# EAGLE design flower (EAGLE 6.1)
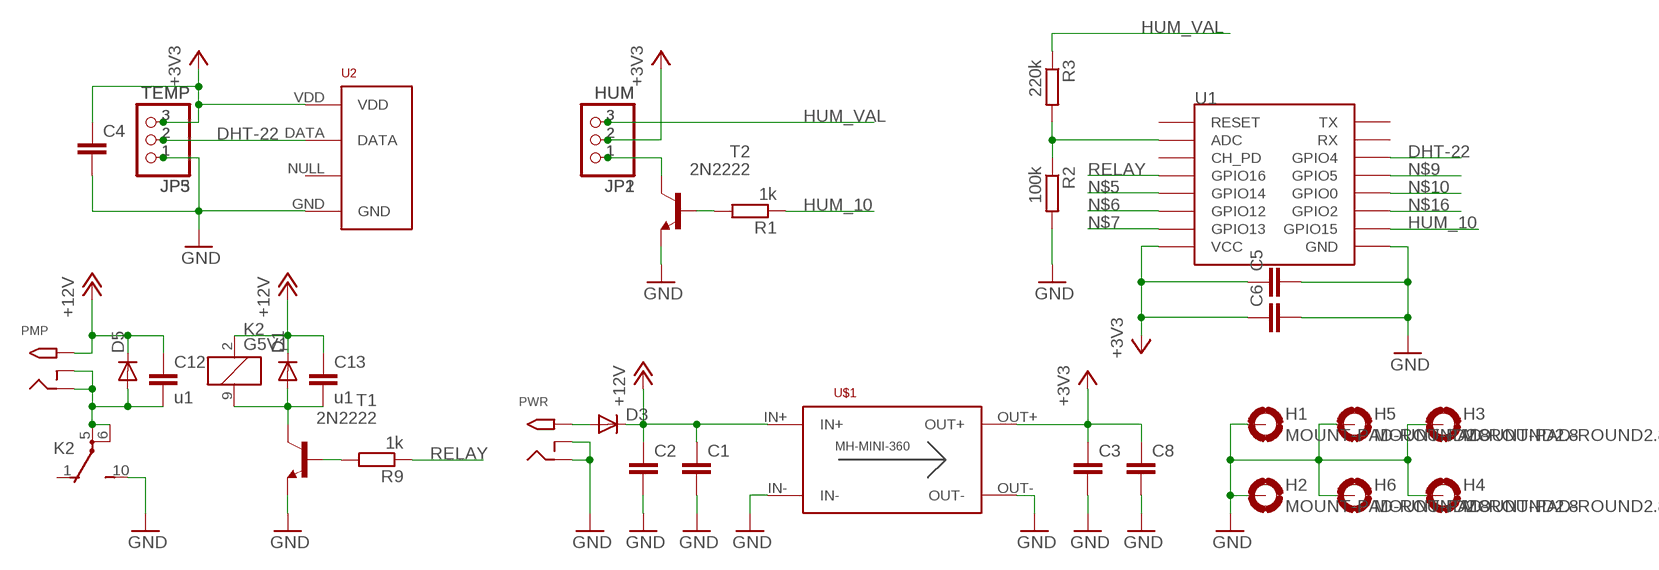
[diagram p0: schematic, sheet 1]

## Parts
C1  C-EU025-025X050  [C025-025X050]
C2  C-EUC0805K  [C0805K]
C3  C-EU025-025X050  [C025-025X050]
C4  C-EU025-025X050  [C025-025X050]
C5  C-EU025-025X050  [C025-025X050]
C6  C-EU025-025X050  [C025-025X050]
C8  C-EUC0805K  [C0805K]
C12  u1  C-EU025-025X050  [C025-025X050]
C13  u1  C-EU025-025X050  [C025-025X050]
D1  DIODE-D-5  [D-5]
D3  DIODE-D-5  [D-5]
D5  DIODE-D-5  [D-5]
H1  MOUNT-PAD-ROUND2.8  [2,8-PAD]
H2  MOUNT-PAD-ROUND2.8  [2,8-PAD]
H3  MOUNT-PAD-ROUND2.8  [2,8-PAD]
H4  MOUNT-PAD-ROUND2.8  [2,8-PAD]
H5  MOUNT-PAD-ROUND2.8  [2,8-PAD]
H6  MOUNT-PAD-ROUND2.8  [2,8-PAD]
JP1  HUM  PINHD-1X3/90  [1X03/90]
JP2  HUM  PINHD-1X3  [1X03]
JP3  TEMP  PINHD-1X3  [1X03]
JP5  TEMP  PINHD-1X3/90  [1X03/90]
K2  G5V1  [G5V1]
PMP  PMP  2.1MMJACKTHM  [PJ-102A]
PWR  PWR  2.1MMJACKTHM  [PJ-102A]
R1  1k  R-EU_0204/7  [0204/7]
R2  100k  R-EU_0204/7  [0204/7]
R3  220k  R-EU_0204/7  [0204/7]
R9  1k  R-EU_0207/10  [0207/10]
T1  2N2222  [TO92-EBC-OVAL]
T2  2N2222  [TO92-EBC-OVAL]
U1  ESP12EDIP  [ESP-12-BREAKOUT]
U2  RHT03_DHT-22_AM2302RA  [RHT03_DHT-22/RA]
U$1  DC-DC_CONV_MINISTD  [DC-DC_CONV_MINI]

## Nets
+3V3: C3.1 C4.1 C5.1 C6.1 C8.1 JP1.2 JP2.2 JP3.3 JP5.3 U1.P$1(VCC) U2.VDD U$1.OUT+
+12V: C1.1 C2.1 C12.1 C13.1 D1.C D3.C D5.C K2.2 PMP.TIP U$1.IN+
DHT-22: JP3.2 JP5.2 U1.P$14(GPIO4) U2.DATA
GND: C1.2 C2.2 C3.2 C4.2 C5.2 C6.2 C8.2 H1.B2,8(MOUNT) H2.B2,8(MOUNT) H3.B2,8(MOUNT) H4.B2,8(MOUNT) H5.B2,8(MOUNT) H6.B2,8(MOUNT) JP3.1 JP5.1 K2.10(2:S) PWR.RING PWR.RING_SW R2.2 T1.E T2.E U1.P$9(GND) U2.GND U$1.IN- U$1.OUT-
HUM_10: R1.1 U1.P$10(GPIO15)
HUM_VAL: JP1.3 JP2.3 R3.1
N$1: R1.2 T2.B
N$2: JP1.1 JP2.1 T2.C
N$3: R2.1 R3.2 U1.P$7(ADC)
N$5: U1.P$4(GPIO14)
N$6: U1.P$3(GPIO12)
N$7: U1.P$2(GPIO13)
N$9: U1.P$13(GPIO5)
N$10: U1.P$12(GPIO0)
N$11: C12.2 D5.A K2.5(2:P) K2.6(2:P) PMP.RING PMP.RING_SW
N$12: D3.A PWR.TIP
N$13: C13.2 D1.A K2.9 T1.C
N$15: R9.2 T1.B
N$16: U1.P$11(GPIO2)
RELAY: R9.1 U1.P$5(GPIO16)
Unconnected: K2.1(2:O) U1.P$6(CH_PD) U1.P$8(RESET) U1.P$15(RX) U1.P$16(TX) U2.NULL

## Library data of the parts
C1-C6 C8 C12 C13 = rcl:C-EU: CAPACITOR, European symbol
D1 D3 D5 = diode:DIODE-: DIODE
H1-H6 = holes:MOUNT-PAD-ROUND: MOUNTING PAD, round
JP1-JP3 JP5 = pinhead:PINHD-1X3: PIN HEADER
K2 = relay:G5V1: RELAY 1 x switch, 0.5 A/125 V AC, 1 A/24 V DC , Omron; MPN: G5V-1-DC24; OC_FARNELL: 9949593; OC_NEWARK: 36M6377
PMP PWR = adafruit:2.1MMJACK: 2.1mm x 5.5mm THM DC jack with internal switch. Digikey part #PJ-102A, 4UCON part #05537 2.1mm x 5.5mm SMT DC jack with internal switch. Digikey part #PJ-002A-SMT, 4UCON part #03267 By microbuilder.eu & adafruit.com
R1-R3 R9 = rcl:R-EU_: RESISTOR, European symbol
T1 T2 = adafruit:2N2222: NPN TRANSISTOR Big oval pads
U1 = _MY_OWN_LIB:ESP12E: ESP12E Module
U2 = RHT03_DHT-22_AM2302:RHT03_DHT-22_AM2302: RHT03 / DHT-22 / AM2302 Packages and symbol for the RHT03 / DHT-22 relative humidity and temperature sensor. Note: The AM2302 is a wired version of the DHT-22 which typically requires less clearance and is thus provided as a separate package.; PROD_ID: SEN-10167
U$1 = _MY_OWN_LIB:DC-DC_CONV_MINI

## Board
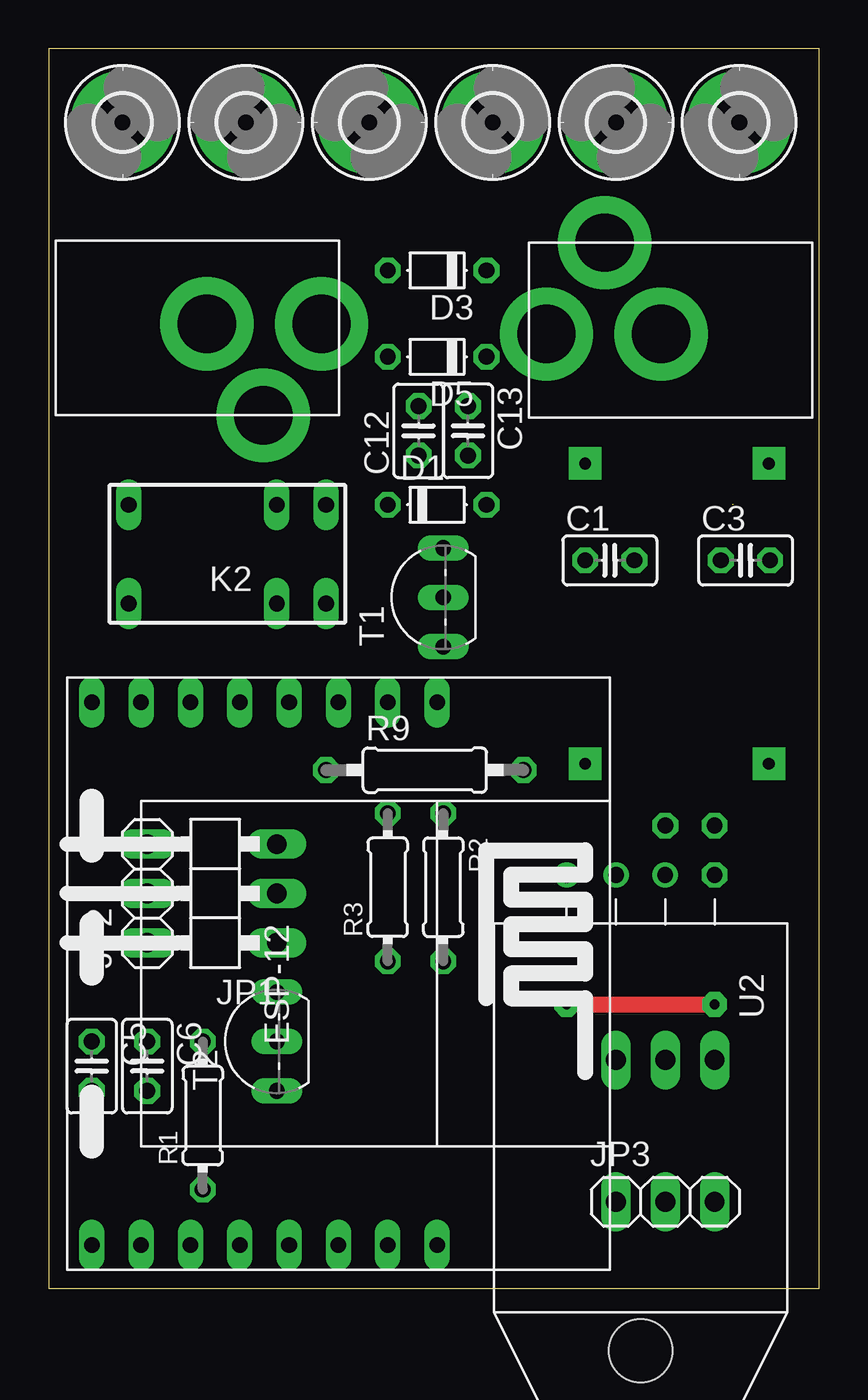
[diagram p1: board, top side]
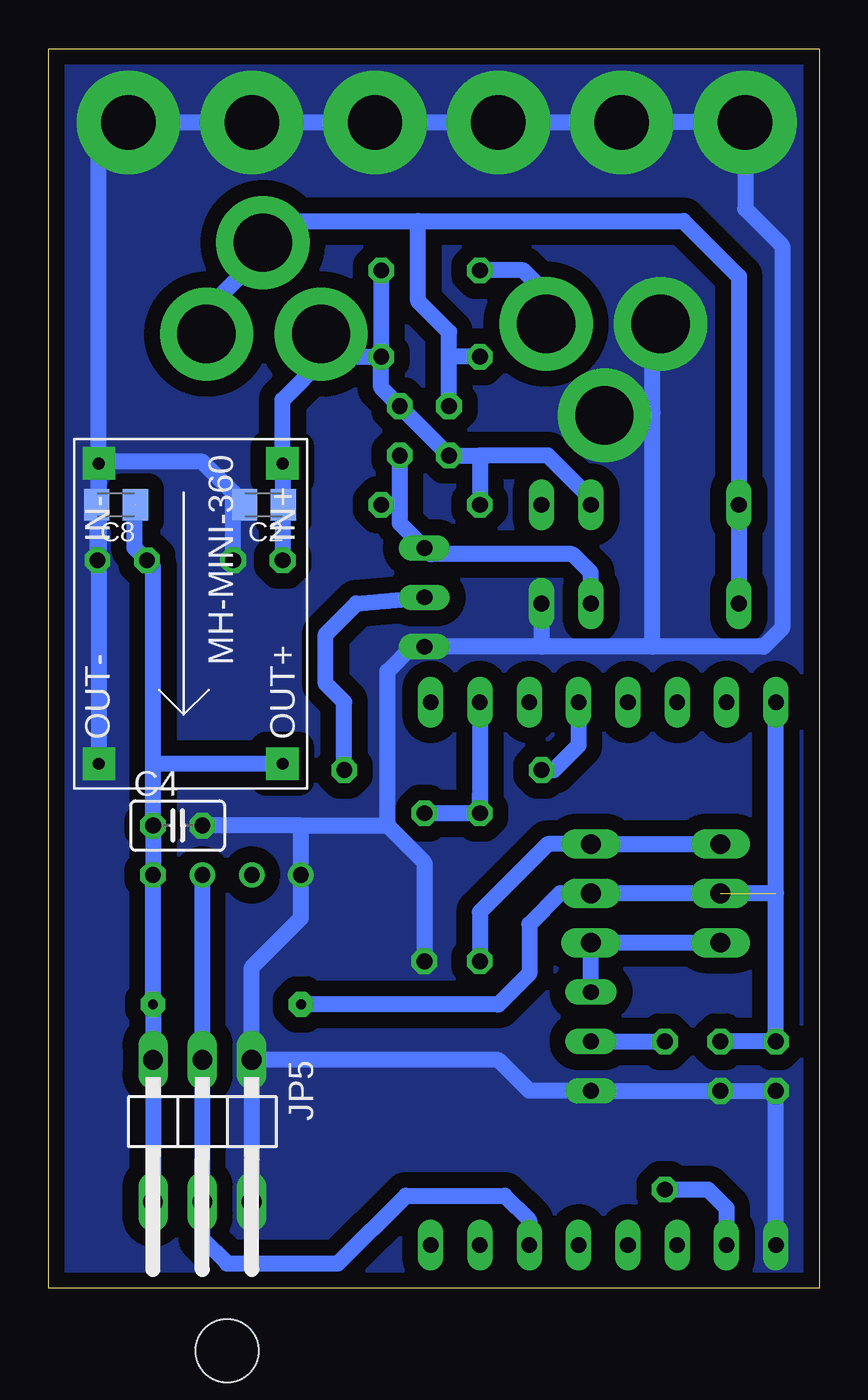
[diagram p2: board, bottom side, seen from below]

Size 39.67 x 63.8 mm. Coordinates in mm from the lower left corner, seen from the top.
Outline: 0,0 39.67,0 39.67,63.8 0,63.8 0,0
Copper layers (1*16): Top 0.035mm / dielectric 1.5mm / Bottom 0.035mm
Design rules: minimum track width 10mil, minimum drill 24mil, track to track 12mil, track to pad 12mil, pad to pad 12mil, via to via 12mil, smd to smd 10mil, copper to edge 12mil, drill to drill 12mil, minimum pad ring 10mil, minimum via ring 10mil, stop-mask expansion 4mil, vias tented up to drill 0mil, thermal gap 12mil

### Footprints (pad centres in the part's own frame; a part is rotated, then mirrored left to right if it is on the bottom)
C025-025X050 = drill 0.813 octagon: 1 -1.27,0; 2 1.27,0
C0805K = smd 1.3 x 1.6: 1 -1,0; 2 1,0
D-5 = drill 0.813 octagon: A 2.54,0; C -2.54,0
2,8-PAD = drill 2.8 pad 5.334: B2,8 0,0
1X03/90 = drill 1.016 long: 1 -2.54,-3.81; 2 0,-3.81; 3 2.54,-3.81
1X03 = drill 1.016 long: 1 -2.54,0; 2 0,0; 3 2.54,0
G5V1 = drill 0.813 long: 1 -5.08,-2.54; 2 -2.54,-2.54; 5 5.08,-2.54; 6 5.08,2.54; 9 -2.54,2.54; 10 -5.08,2.54
PJ-102A = drill 3 pad 4.8: RING 0.1,-3.39; RING_SW -4.6,-6.29; TIP 0.1,-9.29
0204/7 = drill 0.813 octagon: 1 -3.81,0; 2 3.81,0
0207/10 = drill 0.813 octagon: 1 -5.08,0; 2 5.08,0
TO92-EBC-OVAL = drill 0.813 long: B 0,-1.27; C 2.54,-1.27; E -2.54,-1.27
ESP-12-BREAKOUT = drill 0.8 long: P$1 0,0; P$2 0,2.54; P$3 0,5.08; P$4 0,7.62; P$5 0,10.16; P$6 0,12.7; P$7 0,15.24; P$8 0,17.78; P$9 27.94,0; P$10 27.94,2.54; P$11 27.94,5.08; P$12 27.94,7.62; P$13 27.94,10.16; P$14 27.94,12.7; P$15 27.94,15.24; P$16 27.94,17.78
RHT03_DHT-22/RA = drill 0.8: DATA -1.27,0; GND 3.81,0; NULL 1.27,0 | drill 0.8 octagon: VDD -3.81,0 | hole 3.25: 0,24.5
DC-DC_CONV_MINI = drill 0.6 pad 1.676 square: IN+ 16.73,1.27; IN- 16.73,10.73; OUT+ 1.27,1.27; OUT- 1.27,10.73

### Placement (x,y rotation side)
C1  28.89,37.47 0 top
C2  28.57,40.32 180 bottom
C3  35.88,37.47 0 top
C4  33.02,23.81 0 bottom
C5  2.22,11.43 270 top
C6  5.08,11.43 270 top
C8  36.2,40.32 180 bottom
C12  19.05,44.13 90 top
C13  21.59,44.13 270 top
D1  20,40.32 0 top
D3  20,52.39 180 top
D5  20,47.94 180 top
H1  35.56,60.01 0 top
H2  3.81,60.01 0 top
H3  22.86,60.01 0 top
H4  29.21,60.01 90 top
H5  10.16,60.01 90 top
H6  16.51,60.01 90 top
JP1  7.94,20.32 90 top
JP2  5.08,20.32 90 top
JP3  31.75,4.45 0 top
JP5  31.75,7.94 180 bottom
K2  9.21,37.78 180 top
PMP  34.92,49.21 270 top
PWR  4.76,49.53 90 top
R1  7.94,8.89 90 top
R2  20.32,20.64 270 top
R3  17.46,20.64 90 top
R9  19.37,26.67 0 top
T1  19.05,35.56 90 top
T2  10.48,12.7 90 top
U1  2.22,30.16 270 top
U2  30.48,21.27 180 top
U$1  26.35,25.72 90 bottom

### Tracks (layer width: path | path; a pad name or v marks a point on that pad's centre or on a via)
+3V3  (via drill 0.5 pad 1.27)  (2 unrouted)
  Top 0.813: v26.67,14.61 v34.29,14.61
  Bottom 0.813: 2.22,20.32 JP1.2 13.34,20.32 14.92,18.73 14.92,16.19 16.51,14.61 v26.67,14.61 | 34.29,26.99 C4.1 U2.VDD v34.29,14.61 JP5.3 JP3.3 | 34.29,26.99 34.29,37.15 C3.1 35.24,38.1 35.24,40.32 | U$1.OUT+ 34.29,26.99 | 2.22,20.32 C5.1 C6.1 | 2.22,20.32 U1.P$1
+12V
  Bottom 0.813: 25.4,47.94 D5.C | D3.C D5.C | 25.4,47.94 25.4,48.88 PMP.TIP | D5.C 22.54,46.35 C13.1 C12.1 17.46,42.86 | U$1.IN+ C1.1 | U$1.IN+ 27.62,40.37 C2.1 | U$1.IN+ 27.62,45.72 25.4,47.94 | 17.46,42.86 13.97,42.86 11.75,40.64 K2.2 | 17.46,42.86 D1.C
DHT-22
  Bottom 0.813: U1.P$14 14.92,3.49 16.19,4.76 21.27,4.76 24.77,1.27 30.48,1.27 31.75,2.54 JP3.2 JP5.2 U2.DATA
GND
  Bottom 0.813: 26.67,23.81 U2.GND 26.67,19.05 29.21,16.51 JP5.1 | 26.67,23.81 C4.2 | U$1.IN- U$1.OUT- | C3.2 37.15,40.27 C8.2 37.08,40.44 U$1.IN- | U$1.IN- 37.08,58.48 H1.B2,8 H4.B2,8 H3.B2,8 H6.B2,8 H5.B2,8 H2.B2,8 3.81,55.56 1.91,53.66 1.91,33.97 2.86,33.02 8.57,33.02 | C2.2 29.57,40.37 29.8,40.37 30.16,40.32 | U$1.IN- 36.98,42.55 31.75,42.55 30.16,40.96 30.16,40.32 | C1.2 30.16,40.32 | 22.23,23.81 20.32,21.91 R2.2 | 26.67,23.81 22.23,23.81 | JP5.1 16.51,11.75 14.92,10.16 T2.E C6.2 C5.2 U1.P$9 | JP5.1 JP3.1 | 8.57,33.02 8.57,45.09 | 8.57,45.09 8.57,49.21 8.26,49.53 | 22.23,23.81 22.23,31.75 20.95,33.02 T1.E 14.29,33.02 | 8.57,33.02 14.29,33.02 | K2.10 14.29,33.02 | 11.27,44.93 8.73,44.93 8.57,45.09
  pour Bottom (isolate 0.813, no thermals): 0,0 39.69,0 39.69,63.82 0,63.82
HUM_10
  Bottom 0.813: R1.1 5.71,5.08 4.76,4.13 U1.P$10
HUM_VAL
  Bottom 0.813: JP2.3 JP1.3 13.97,22.86 17.46,19.37 R3.1
N$1
  Bottom 0.813: T2.B R1.2
N$2
  Bottom 0.813: JP2.1 JP1.1 T2.C
N$3
  Bottom 0.813: U1.P$7 R3.2 | R3.2 R2.1 | R3.2 17.46,25.4
N$11
  Bottom 0.813: C12.2 19.05,47.94 | 19.05,47.94 19.05,49.21 20.64,50.8 20.64,54.93 | PMP.RING 31.54,50.38 28.42,53.5 | 28.42,53.5 26.99,54.93 20.64,54.93 | PMP.RING_SW 28.64,53.72 28.42,53.5 | D5.A 19.05,47.94 | 20.64,54.93 6.99,54.93 4.13,52.07 K2.5 K2.6
N$12
  Bottom 0.813: PWR.TIP 14.07,51.22 15.24,52.39 D3.A
N$13
  Bottom 0.813: C13.2 21.59,40.32 | 21.59,40.32 21.59,39.37 T1.C 20,37.78 12.7,37.78 11.75,36.83 K2.9 | D1.A 21.59,40.32
N$15
  Bottom 0.813: R9.2 24.45,30.16 25.4,31.11 25.4,33.66 23.81,35.24 T1.B
RELAY
  Bottom 0.813: U1.P$5 12.38,27.94 13.65,26.67 R9.1